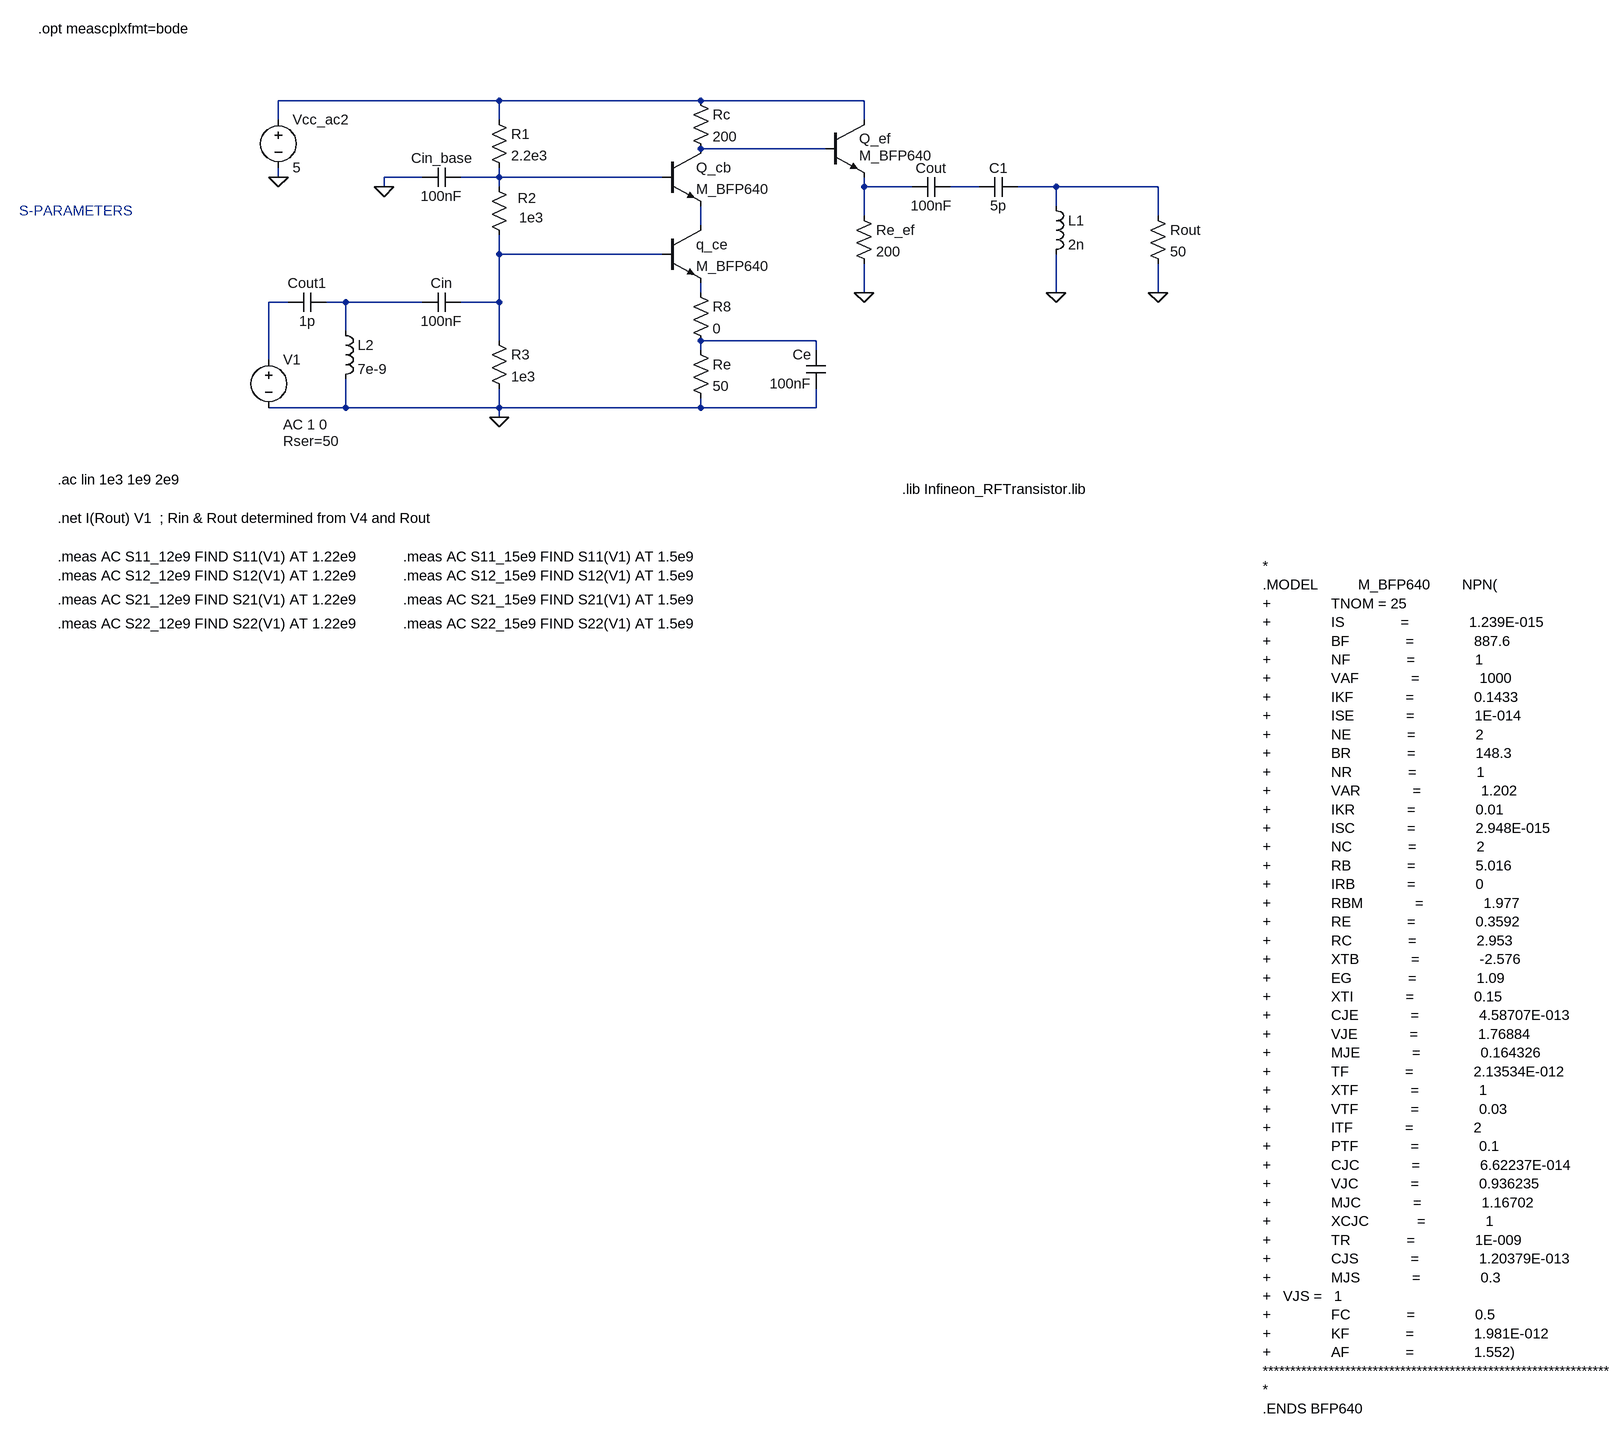
[diagram p0: schematic LNA_IMPEDANCE.asc]
LNA_IMPEDANCE.asc, the LTspice schematic file:
Version 4
SHEET 1 3348 3192
WIRE -80 592 -448 592
WIRE 256 592 -80 592
WIRE 528 592 256 592
WIRE -448 624 -448 592
WIRE -80 624 -80 592
WIRE 528 624 528 592
WIRE 464 672 256 672
WIRE -448 720 -448 704
WIRE -208 720 -272 720
WIRE -80 720 -80 704
WIRE -80 720 -144 720
WIRE 192 720 -80 720
WIRE -272 736 -272 720
WIRE -80 736 -80 720
WIRE 528 736 528 720
WIRE 608 736 528 736
WIRE 720 736 672 736
WIRE 848 736 784 736
WIRE 1088 736 848 736
WIRE 848 768 848 736
WIRE 528 784 528 736
WIRE 1088 784 1088 736
WIRE 256 800 256 768
WIRE -80 848 -80 816
WIRE 192 848 -80 848
WIRE 256 912 256 896
WIRE 528 912 528 864
WIRE 848 912 848 848
WIRE 1088 912 1088 864
WIRE -432 928 -464 928
WIRE -336 928 -368 928
WIRE -208 928 -336 928
WIRE -80 928 -80 848
WIRE -80 928 -144 928
WIRE -336 976 -336 928
WIRE -80 992 -80 928
WIRE 448 992 256 992
WIRE 256 1008 256 992
WIRE 448 1008 448 992
WIRE -464 1024 -464 928
WIRE -336 1104 -336 1056
WIRE -336 1104 -464 1104
WIRE -80 1104 -80 1072
WIRE -80 1104 -336 1104
WIRE 256 1104 256 1088
WIRE 256 1104 -80 1104
WIRE 448 1104 448 1072
WIRE 448 1104 256 1104
WIRE -80 1120 -80 1104
FLAG -448 720 0
FLAG -80 1120 0
FLAG -272 736 0
FLAG 528 912 0
FLAG 1088 912 0
FLAG 848 912 0
SYMBOL voltage -448 608 R0
WINDOW 123 0 0 Left 0
WINDOW 39 0 0 Left 0
SYMATTR InstName Vcc_ac2
SYMATTR Value 5
SYMBOL npn 192 800 R0
SYMATTR InstName q_ce
SYMATTR Value M_BFP640
SYMBOL res -96 608 R0
SYMATTR InstName R1
SYMATTR Value 2.2e3
SYMBOL res -96 976 R0
SYMATTR InstName R3
SYMATTR Value 1e3
SYMBOL res 240 992 R0
SYMATTR InstName Re
SYMATTR Value 50
SYMBOL res 240 576 R0
SYMATTR InstName Rc
SYMATTR Value 200
SYMBOL cap -144 912 R90
WINDOW 0 0 32 VBottom 2
WINDOW 3 32 32 VTop 2
SYMATTR InstName Cin
SYMATTR Value 100nF
SYMBOL res -96 720 R0
WINDOW 0 47 35 Left 2
WINDOW 3 49 67 Left 2
SYMATTR InstName R2
SYMATTR Value 1e3
SYMBOL npn 192 672 R0
SYMATTR InstName Q_cb
SYMATTR Value M_BFP640
SYMBOL cap -144 704 R90
WINDOW 0 0 32 VBottom 2
WINDOW 3 32 32 VTop 2
SYMATTR InstName Cin_base
SYMATTR Value 100nF
SYMBOL cap 464 1072 R180
WINDOW 0 24 56 Left 2
WINDOW 3 24 8 Left 2
SYMATTR InstName Ce
SYMATTR Value 100nF
SYMBOL npn 464 624 R0
WINDOW 3 56 60 Left 2
SYMATTR InstName Q_ef
SYMATTR Value M_BFP640
SYMBOL res 512 768 R0
SYMATTR InstName Re_ef
SYMATTR Value 200
SYMBOL cap 672 720 R90
WINDOW 0 0 32 VBottom 2
WINDOW 3 32 32 VTop 2
SYMATTR InstName Cout
SYMATTR Value 100nF
SYMBOL res 1072 768 R0
SYMATTR InstName Rout
SYMATTR Value 50
SYMBOL res 240 896 R0
SYMATTR InstName R8
SYMATTR Value 0
SYMBOL voltage -464 1008 R0
WINDOW 123 24 124 Left 2
WINDOW 39 24 152 Left 2
SYMATTR Value2 AC 1 0
SYMATTR SpiceLine Rser=50
SYMATTR InstName V1
SYMATTR Value ""
SYMBOL cap 784 720 R90
WINDOW 0 0 32 VBottom 2
WINDOW 3 32 32 VTop 2
SYMATTR InstName C1
SYMATTR Value 5p
SYMBOL ind 832 752 R0
SYMATTR InstName L1
SYMATTR Value 2n
SYMBOL cap -368 912 R90
WINDOW 0 0 32 VBottom 2
WINDOW 3 32 32 VTop 2
SYMATTR InstName Cout1
SYMATTR Value 1p
SYMBOL ind -352 960 R0
SYMATTR InstName L2
SYMATTR Value 7e-9
TEXT -816 1224 Left 2 !.ac lin 1e3 1e9 2e9
TEXT -816 1288 Left 2 !.net I(Rout) V1  ; Rin & Rout determined from V4 and Rout
TEXT -880 776 Left 2 ;S-PARAMETERS
TEXT -816 1352 Left 2 !.meas AC S11_12e9 FIND S11(V1) AT 1.22e9
TEXT -848 472 Left 2 !.opt meascplxfmt=bode
TEXT -816 1384 Left 2 !.meas AC S12_12e9 FIND S12(V1) AT 1.22e9
TEXT -816 1424 Left 2 !.meas AC S21_12e9 FIND S21(V1) AT 1.22e9
TEXT -816 1464 Left 2 !.meas AC S22_12e9 FIND S22(V1) AT 1.22e9
TEXT -240 1352 Left 2 !.meas AC S11_15e9 FIND S11(V1) AT 1.5e9
TEXT -240 1384 Left 2 !.meas AC S12_15e9 FIND S12(V1) AT 1.5e9
TEXT -240 1424 Left 2 !.meas AC S21_15e9 FIND S21(V1) AT 1.5e9
TEXT -240 1464 Left 2 !.meas AC S22_15e9 FIND S22(V1) AT 1.5e9
TEXT 592 1240 Left 2 !.lib Infineon_RFTransistor.lib
TEXT 2424 1368 Left 2 !*\n.MODEL          M_BFP640        NPN(\n+               TNOM = 25\n+               IS              =               1.239E-015\n+               BF              =               887.6\n+               NF              =               1\n+               VAF             =               1000\n+               IKF             =               0.1433\n+               ISE             =               1E-014\n+               NE              =               2\n+               BR              =               148.3\n+               NR              =               1\n+               VAR             =               1.202\n+               IKR             =               0.01\n+               ISC             =               2.948E-015\n+               NC              =               2\n+               RB              =               5.016\n+               IRB             =               0\n+               RBM             =               1.977\n+               RE              =               0.3592\n+               RC              =               2.953\n+               XTB             =               -2.576\n+               EG              =               1.09\n+               XTI             =               0.15\n+               CJE             =               4.58707E-013\n+               VJE             =               1.76884\n+               MJE             =               0.164326\n+               TF              =               2.13534E-012\n+               XTF             =               1\n+               VTF             =               0.03\n+               ITF             =               2\n+               PTF             =               0.1\n+               CJC             =               6.62237E-014\n+               VJC             =               0.936235\n+               MJC             =               1.16702\n+               XCJC            =               1\n+               TR              =               1E-009\n+               CJS             =               1.20379E-013\n+               MJS             =               0.3\n+   VJS =   1\n+               FC              =               0.5\n+               KF              =               1.981E-012\n+               AF              =               1.552)\n***************************************************************\n*\n.ENDS BFP640

The netlist it stands for:
* LNA_IMPEDANCE.asc
Vcc_ac2 N001 0 5
q_ce N007 N008 N009 0 M_BFP640
R1 N001 N003 2.2e3
R3 N008 0 1e3
Re N012 0 50
Rc N001 N002 200
Cin N008 N011 100nF
R2 N003 N008 1e3
Q_cb N002 N003 N007 0 M_BFP640
Cin_base N003 0 100nF
Ce 0 N012 100nF
Q_ef N001 N002 N004 0 M_BFP640
Re_ef N004 0 200
Cout N005 N004 100nF
Rout N006 0 50
R8 N009 N012 0
V1 N010 0 AC 1 0 Rser=50
C1 N006 N005 5p
L1 N006 0 2n
Cout1 N011 N010 1p
L2 N011 0 7e-9
.model NPN NPN
.model PNP PNP
.lib standard.bjt
.ac lin 1e3 1e9 2e9
.net I(Rout) V1  ; Rin & Rout determined from V4 and Rout
* S-PARAMETERS
.meas AC S11_12e9 FIND S11(V1) AT 1.22e9
.opt meascplxfmt=bode
.meas AC S12_12e9 FIND S12(V1) AT 1.22e9
.meas AC S21_12e9 FIND S21(V1) AT 1.22e9
.meas AC S22_12e9 FIND S22(V1) AT 1.22e9
.meas AC S11_15e9 FIND S11(V1) AT 1.5e9
.meas AC S12_15e9 FIND S12(V1) AT 1.5e9
.meas AC S21_15e9 FIND S21(V1) AT 1.5e9
.meas AC S22_15e9 FIND S22(V1) AT 1.5e9
.lib Infineon_RFTransistor.lib
*
.MODEL          M_BFP640        NPN(
+               TNOM = 25
+               IS              =               1.239E-015
+               BF              =               887.6
+               NF              =               1
+               VAF             =               1000
+               IKF             =               0.1433
+               ISE             =               1E-014
+               NE              =               2
+               BR              =               148.3
+               NR              =               1
+               VAR             =               1.202
+               IKR             =               0.01
+               ISC             =               2.948E-015
+               NC              =               2
+               RB              =               5.016
+               IRB             =               0
+               RBM             =               1.977
+               RE              =               0.3592
+               RC              =               2.953
+               XTB             =               -2.576
+               EG              =               1.09
+               XTI             =               0.15
+               CJE             =               4.58707E-013
+               VJE             =               1.76884
+               MJE             =               0.164326
+               TF              =               2.13534E-012
+               XTF             =               1
+               VTF             =               0.03
+               ITF             =               2
+               PTF             =               0.1
+               CJC             =               6.62237E-014
+               VJC             =               0.936235
+               MJC             =               1.16702
+               XCJC            =               1
+               TR              =               1E-009
+               CJS             =               1.20379E-013
+               MJS             =               0.3
+   VJS =   1
+               FC              =               0.5
+               KF              =               1.981E-012
+               AF              =               1.552)
***************************************************************
*
.ENDS BFP640
.backanno
.end